# Altium schematic sheet Smoothieboard_v1.1.SchDoc
size A1
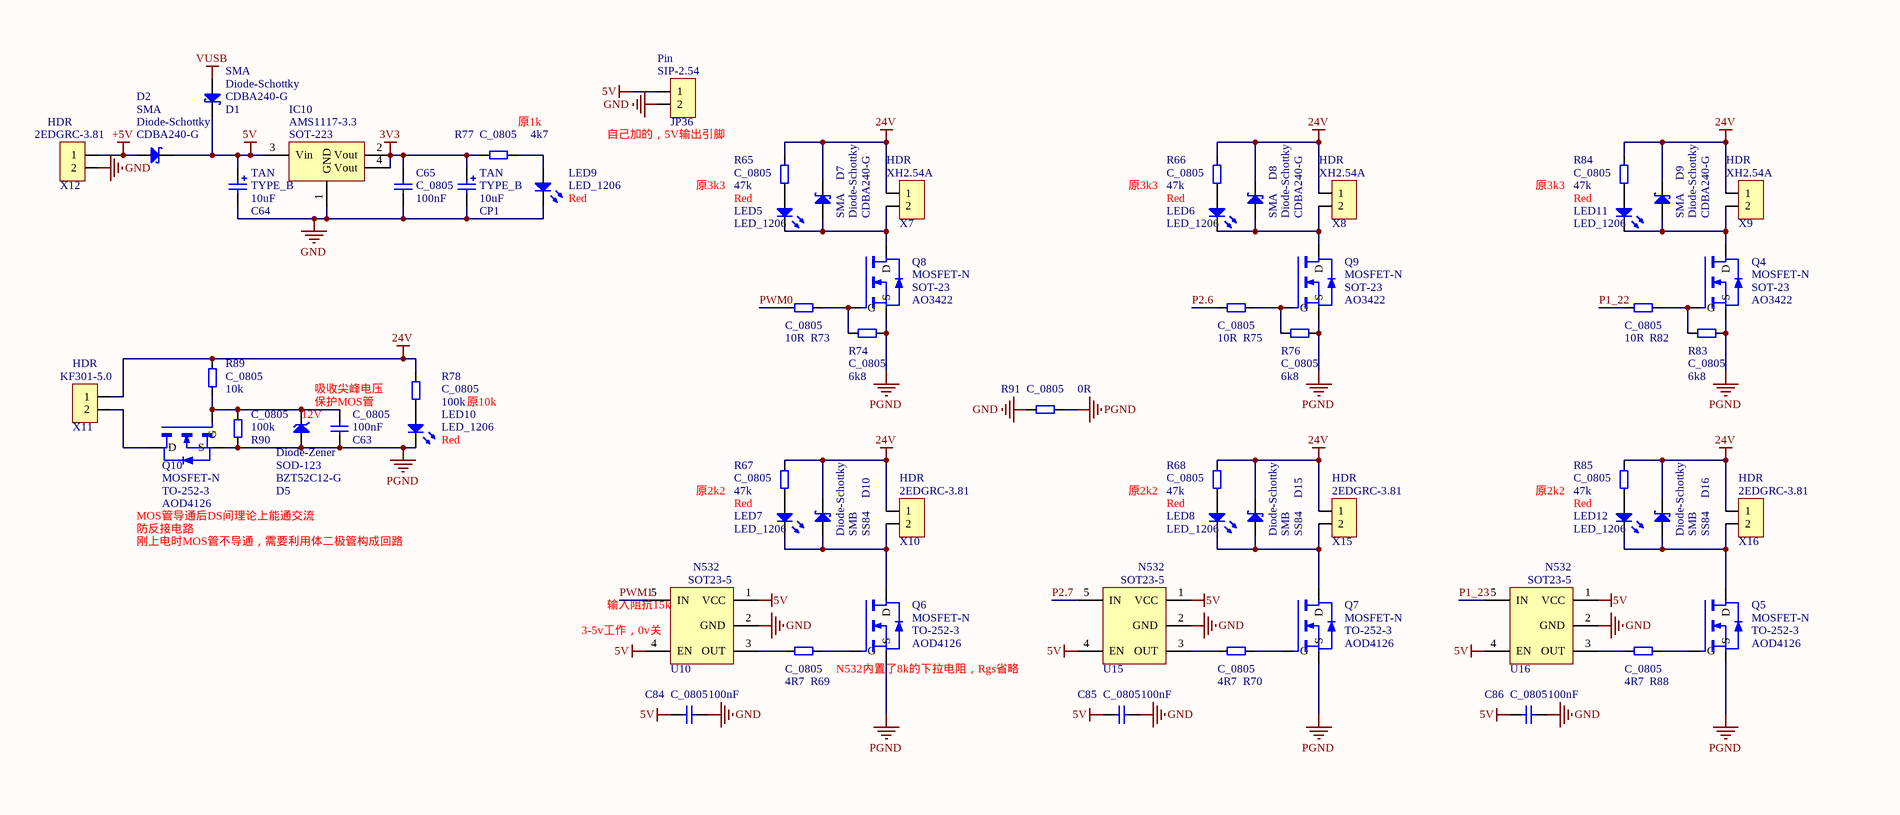
[diagram p0: Smoothieboard_v1.1.SchDoc, top left]
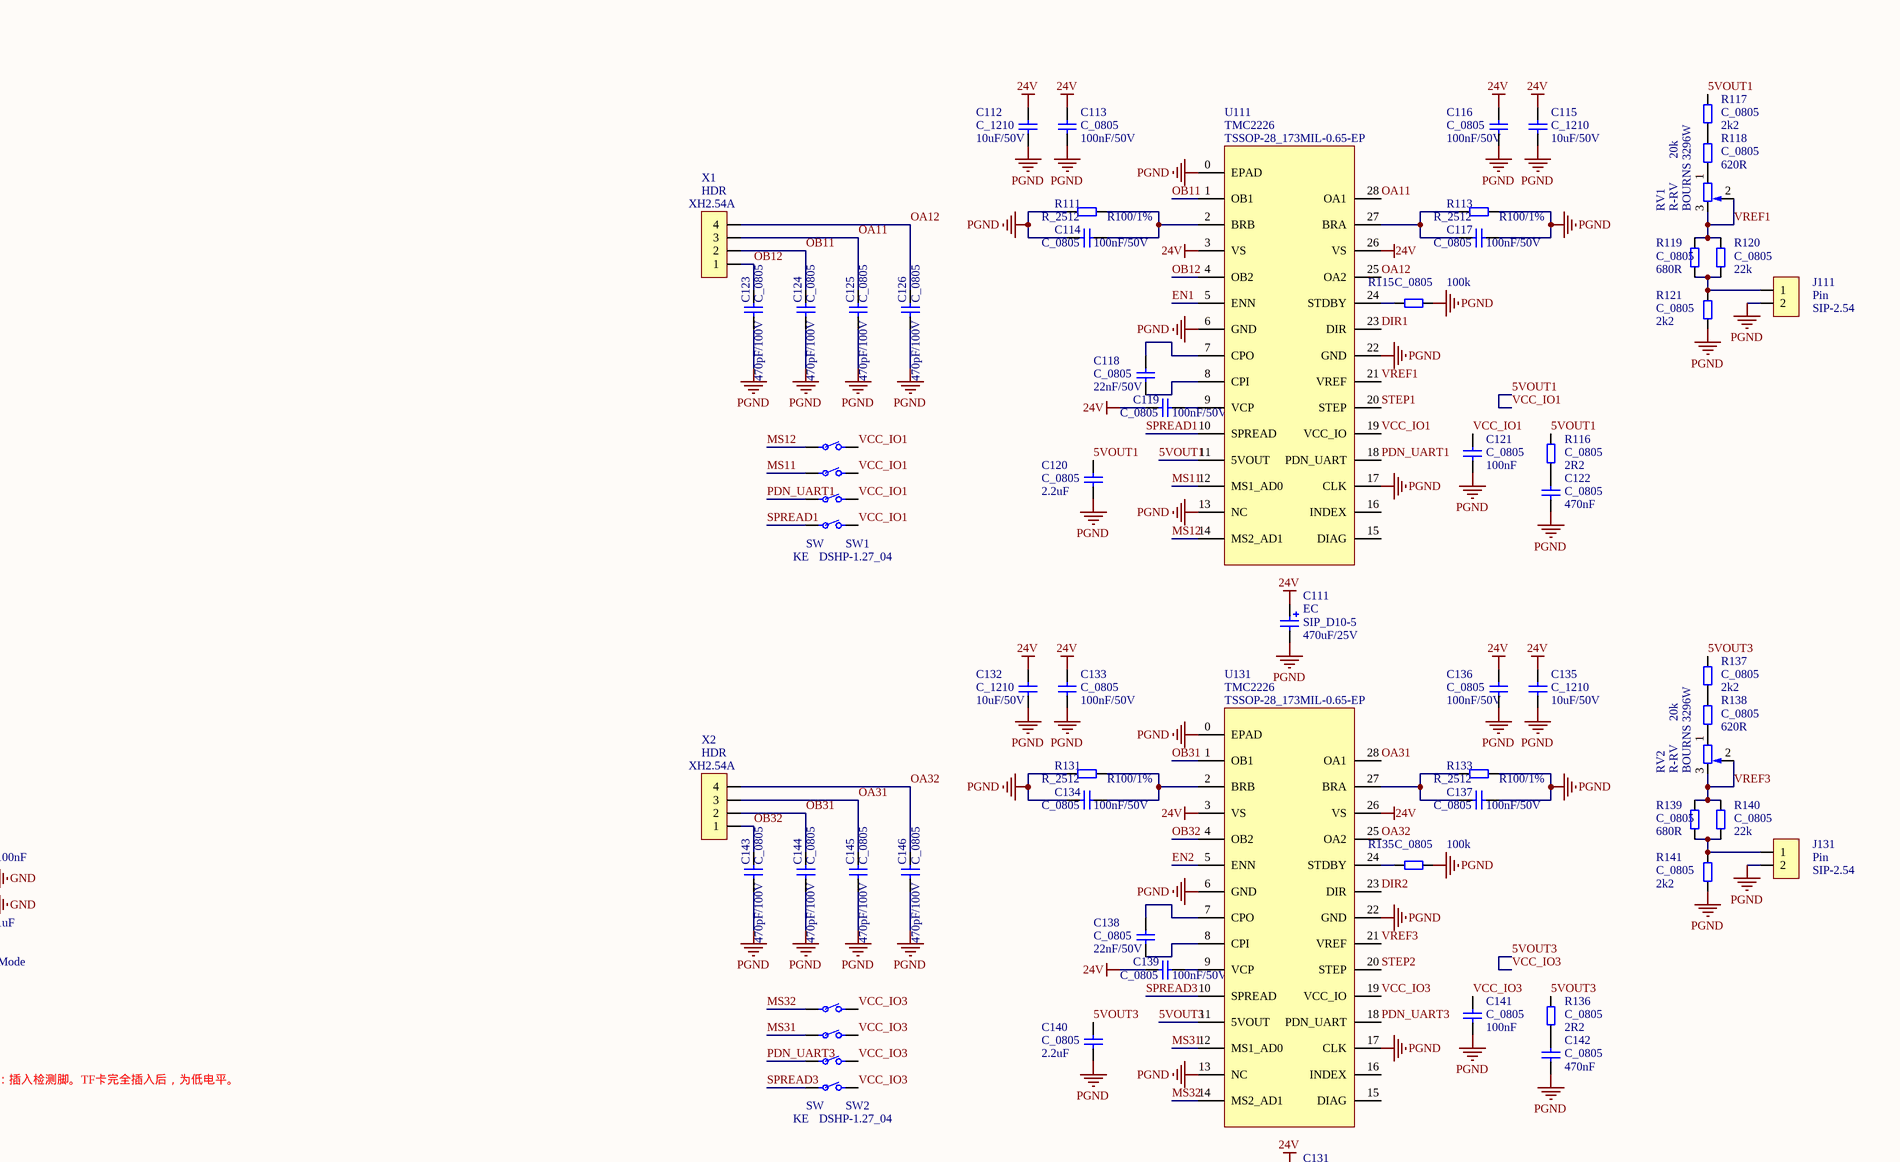
[diagram p1: Smoothieboard_v1.1.SchDoc, top right]
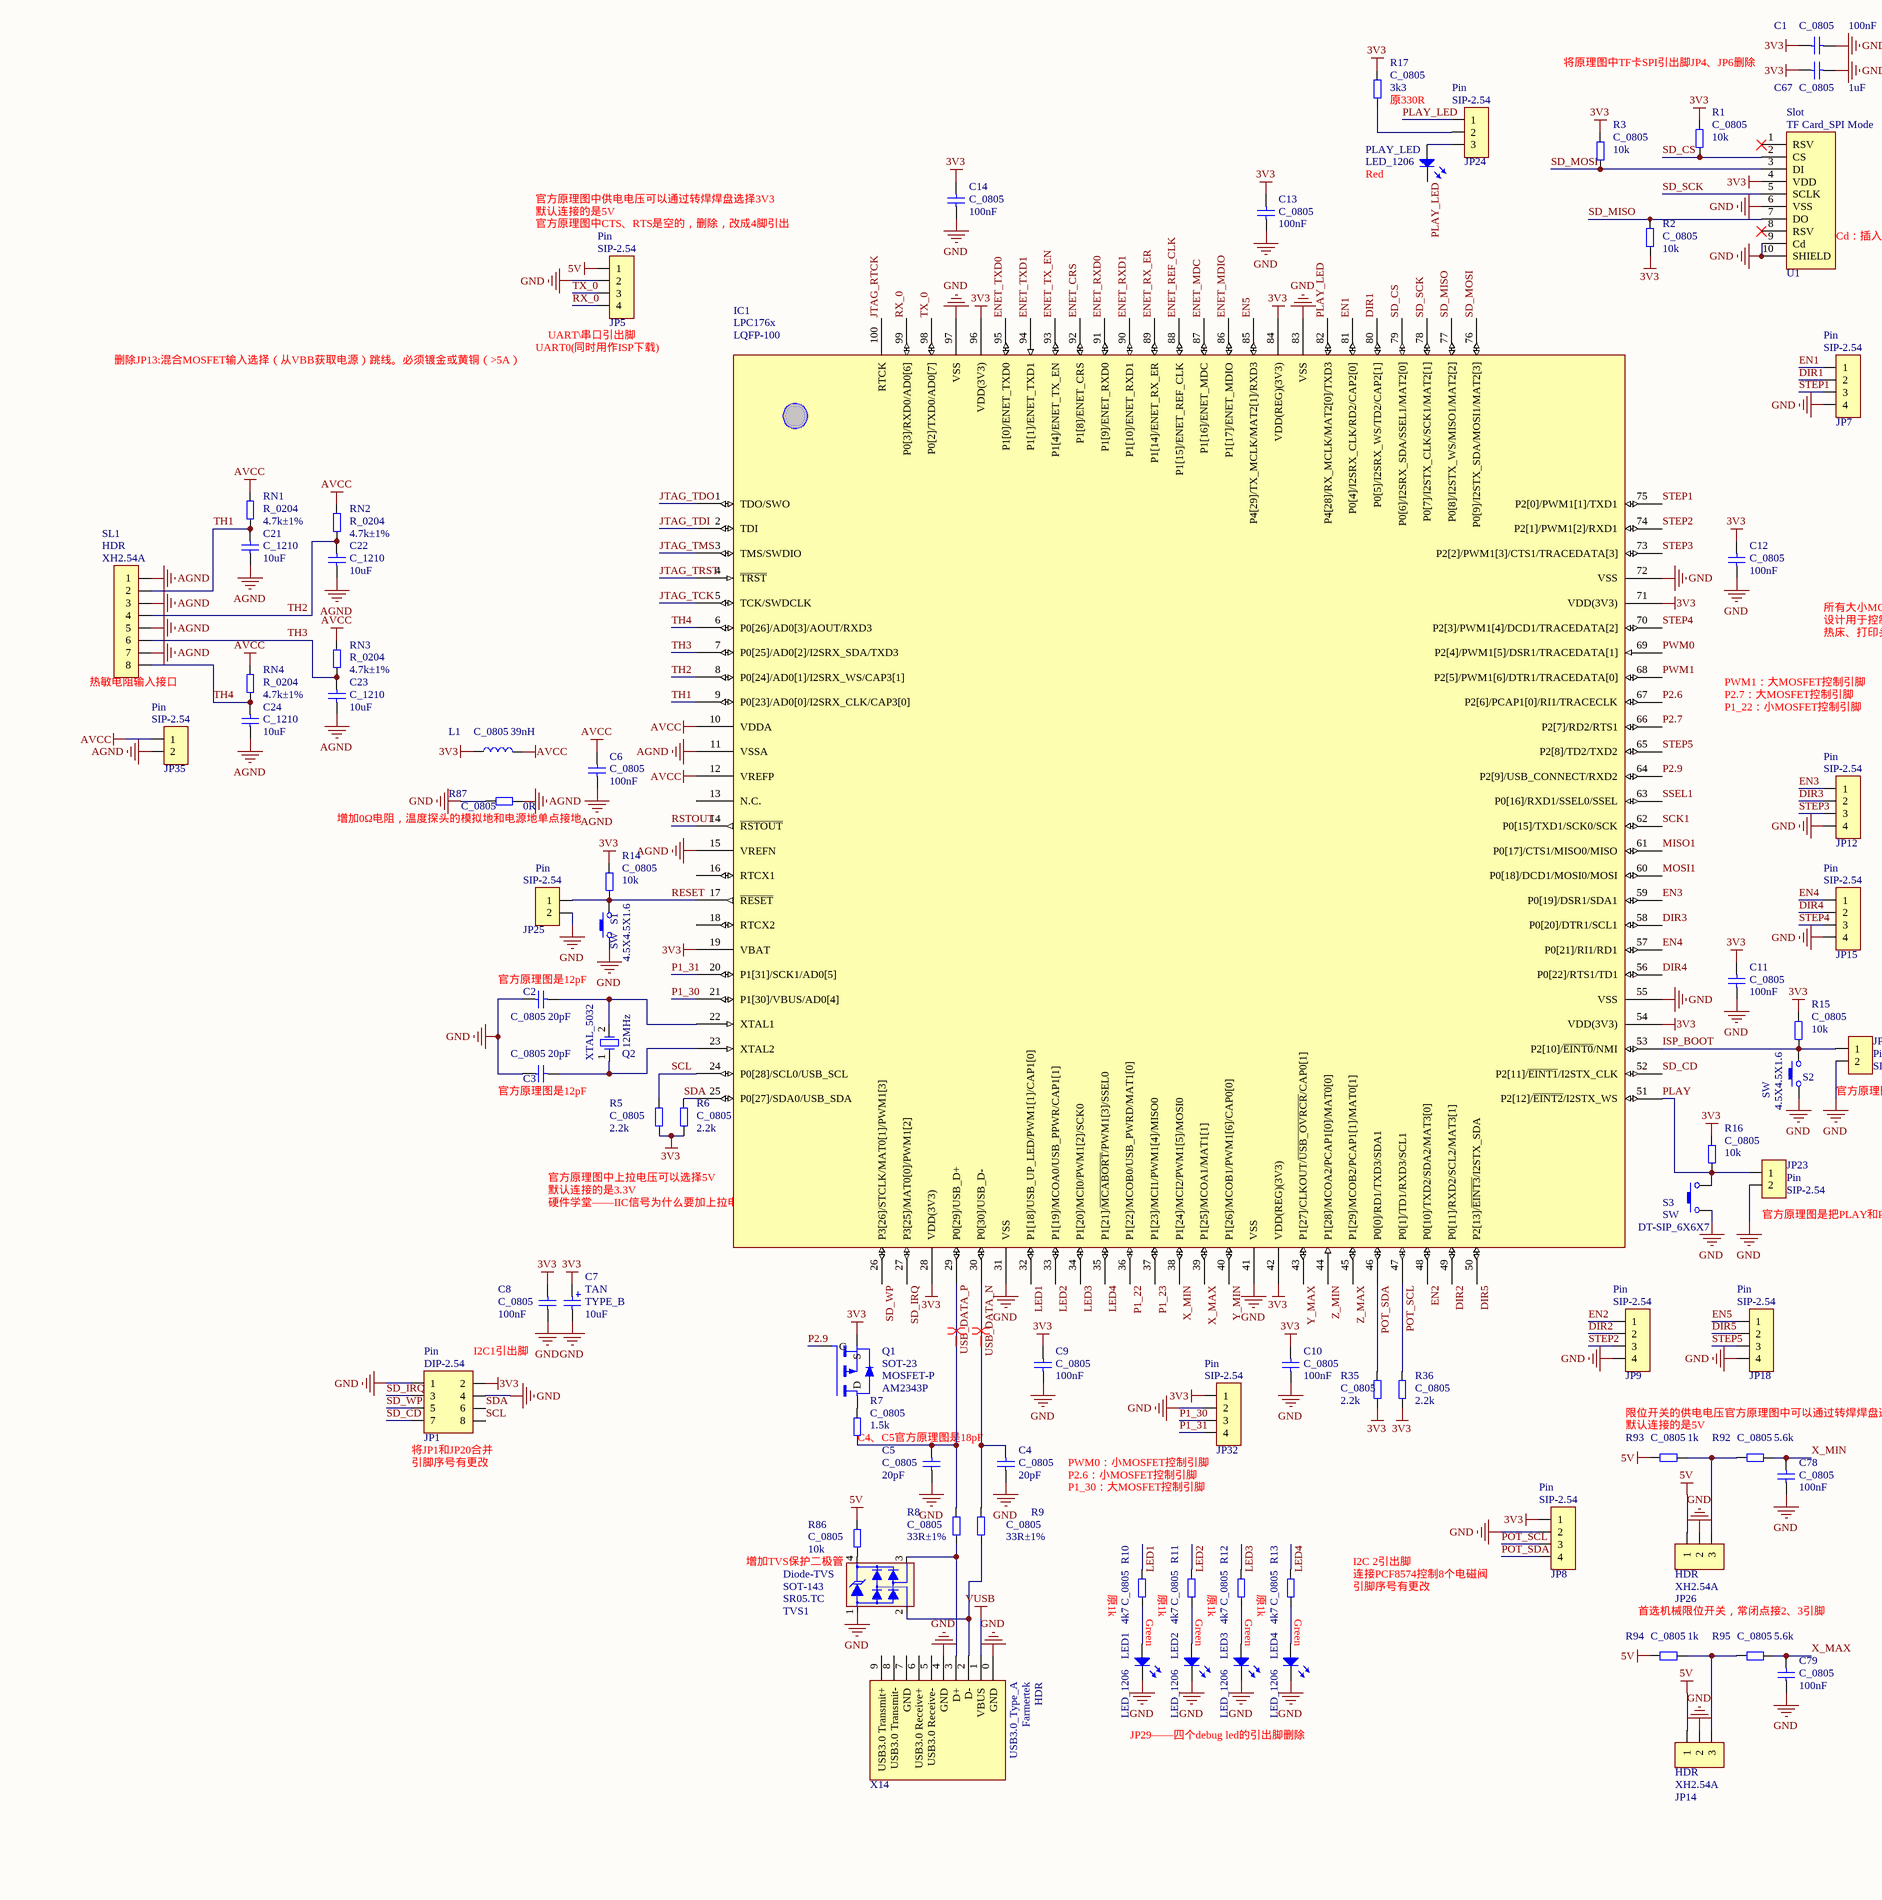
[diagram p2: Smoothieboard_v1.1.SchDoc, bottom left]
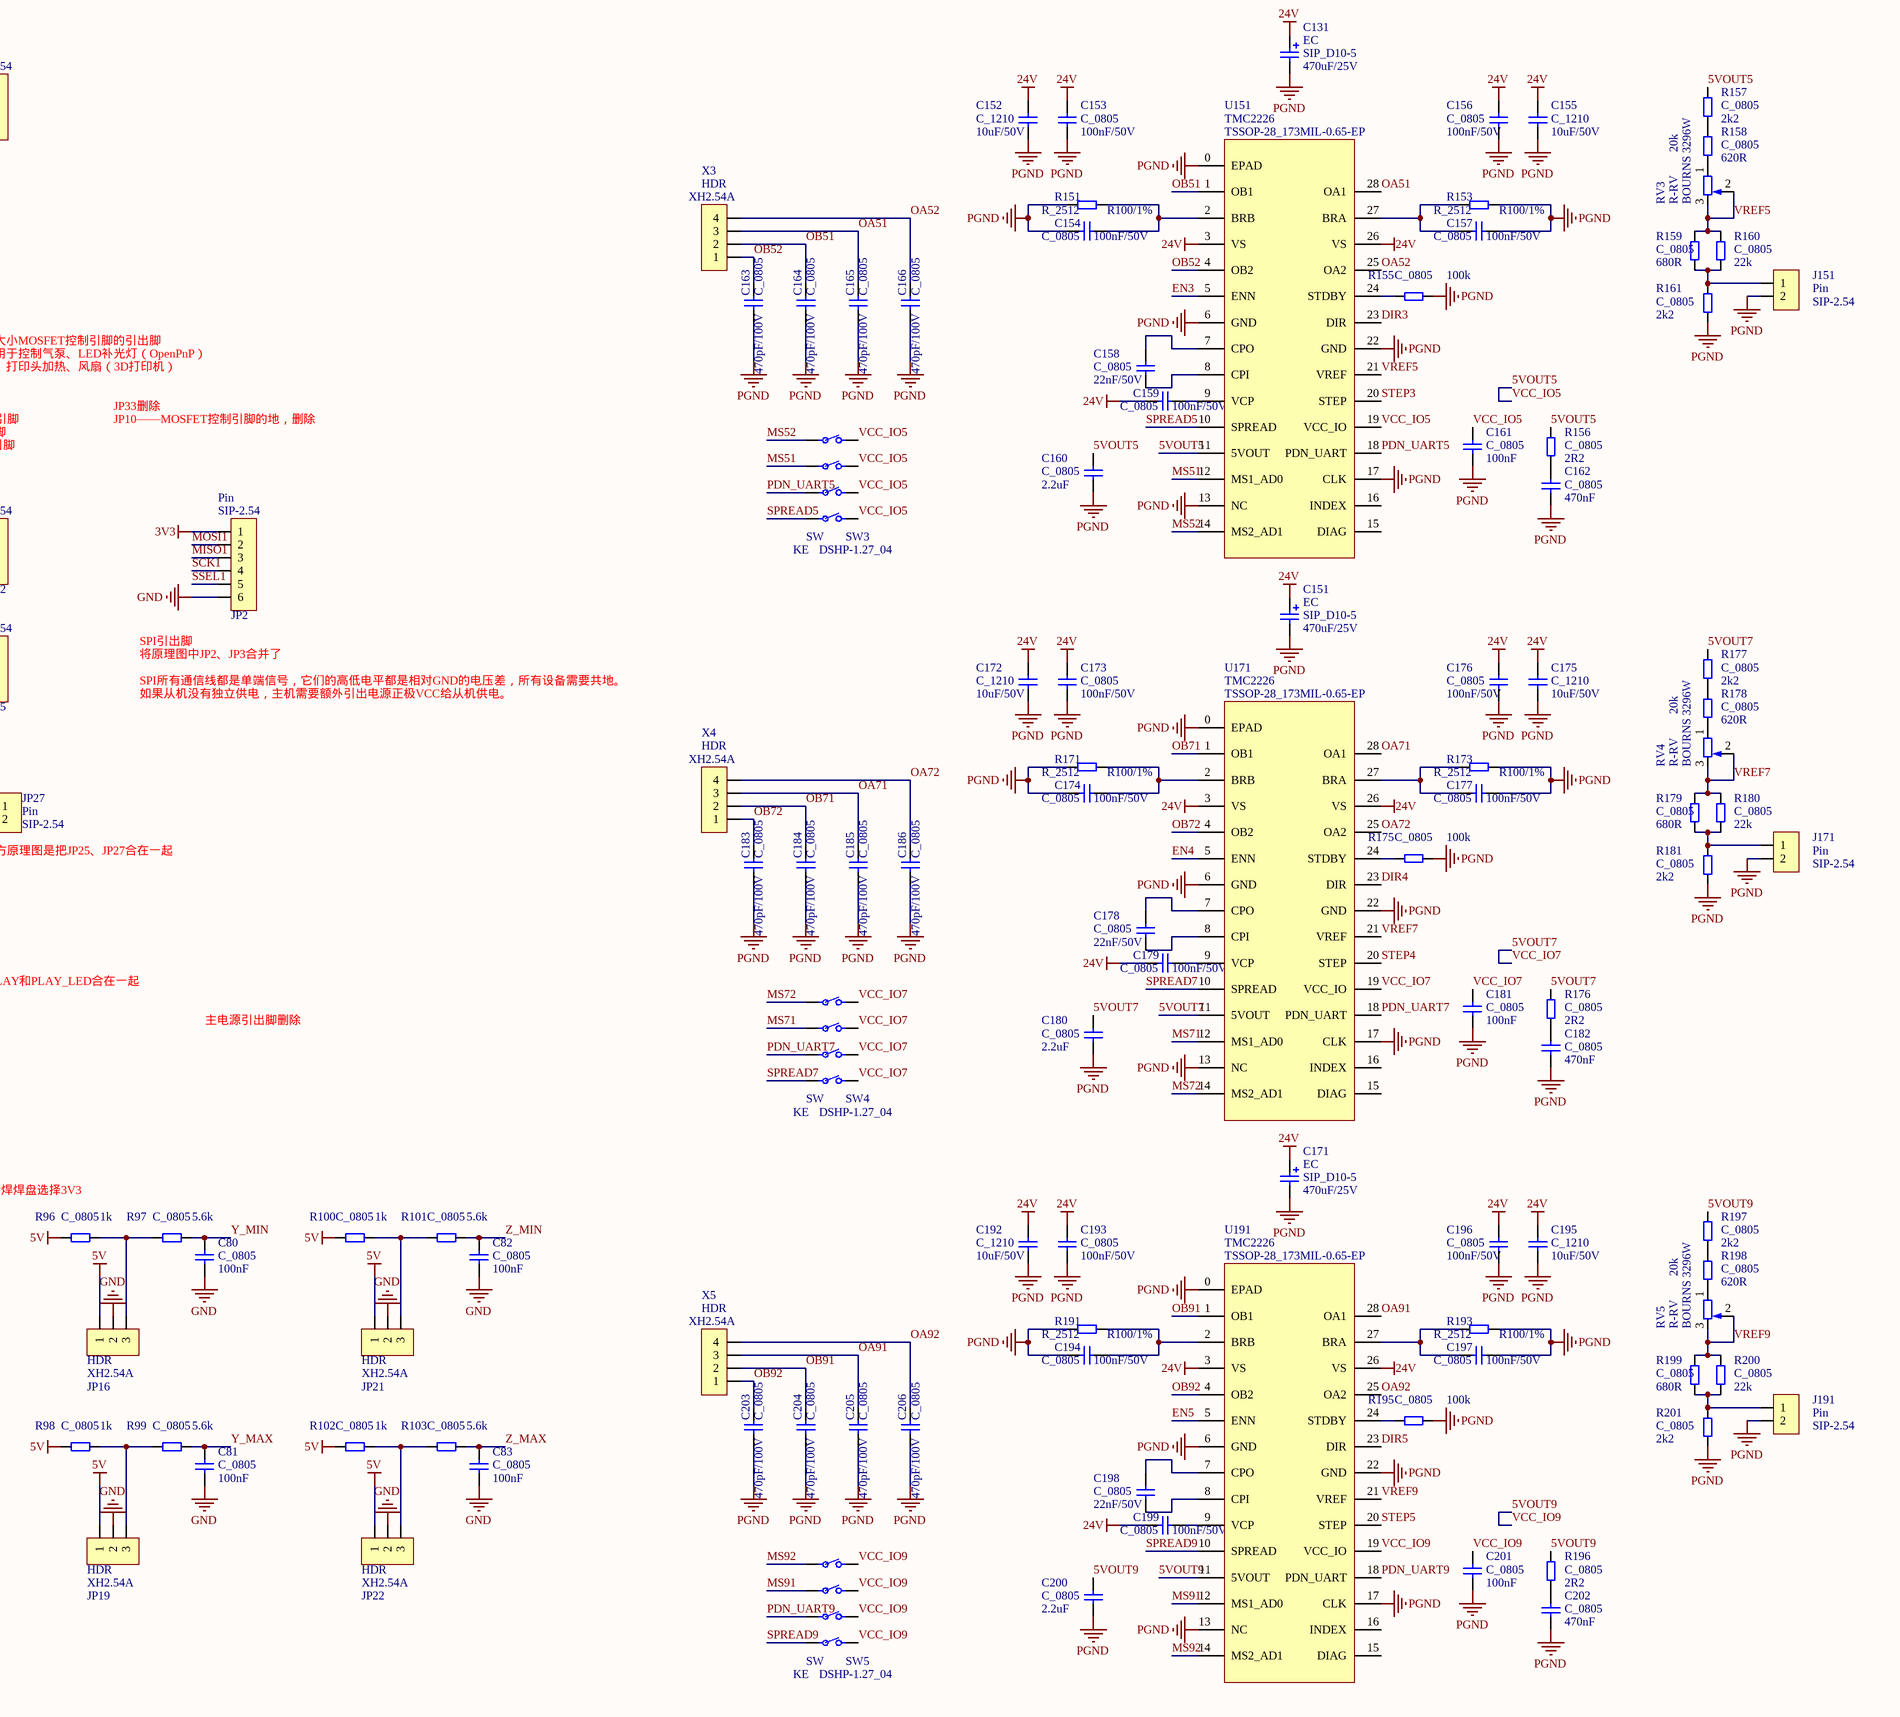
[diagram p3: Smoothieboard_v1.1.SchDoc, bottom right]

## Parts
C1  Type/Value: 100nF  Footprint Index: C_0805  [CAP-MLCC_0805]  (hidden comment: C-MLCC_0805)
C2  Type/Value: 20pF  Footprint Index: C_0805  [CAP-MLCC_0805]  (hidden comment: C-MLCC_0805)
C3  Type/Value: 20pF  Footprint Index: C_0805  [CAP-MLCC_0805]  (hidden comment: C-MLCC_0805)
C4  Type/Value: 20pF  Footprint Index: C_0805  [CAP-MLCC_0805]  (hidden comment: C-MLCC_0805)
C5  Type/Value: 20pF  Footprint Index: C_0805  [CAP-MLCC_0805]  (hidden comment: C-MLCC_0805)
C6  Type/Value: 100nF  Footprint Index: C_0805  [CAP-MLCC_0805]  (hidden comment: C-MLCC_0805)
C7  Footprint Index: TYPE_B  SubClass: TAN  Type/Value: 10uF  [CAP-TAN_TYPE_B]  (hidden comment: C-TAN_Type_B)
C8  Type/Value: 100nF  Footprint Index: C_0805  [CAP-MLCC_0805]  (hidden comment: C-MLCC_0805)
C9  Type/Value: 100nF  Footprint Index: C_0805  [CAP-MLCC_0805]  (hidden comment: C-MLCC_0805)
C10  Type/Value: 100nF  Footprint Index: C_0805  [CAP-MLCC_0805]  (hidden comment: C-MLCC_0805)
C11  Type/Value: 100nF  Footprint Index: C_0805  [CAP-MLCC_0805]  (hidden comment: C-MLCC_0805)
C12  Type/Value: 100nF  Footprint Index: C_0805  [CAP-MLCC_0805]  (hidden comment: C-MLCC_0805)
C13  Type/Value: 100nF  Footprint Index: C_0805  [CAP-MLCC_0805]  (hidden comment: C-MLCC_0805)
C14  Type/Value: 100nF  Footprint Index: C_0805  [CAP-MLCC_0805]  (hidden comment: C-MLCC_0805)
C21  Type/Value: 10uF  Footprint Index: C_1210  [CAP-MLCC_1210]  (hidden comment: C-MLCC_1210)
C22  Type/Value: 10uF  Footprint Index: C_1210  [CAP-MLCC_1210]  (hidden comment: C-MLCC_1210)
C23  Type/Value: 10uF  Footprint Index: C_1210  [CAP-MLCC_1210]  (hidden comment: C-MLCC_1210)
C24  Type/Value: 10uF  Footprint Index: C_1210  [CAP-MLCC_1210]  (hidden comment: C-MLCC_1210)
C63  Type/Value: 100nF  Footprint Index: C_0805  [CAP-MLCC_0805]  (hidden comment: C-MLCC_0805)
C64  Footprint Index: TYPE_B  SubClass: TAN  Type/Value: 10uF  [CAP-TAN_TYPE_B]  (hidden comment: C-TAN_Type_B)
C65  Type/Value: 100nF  Footprint Index: C_0805  [CAP-MLCC_0805]  (hidden comment: C-MLCC_0805)
C67  Type/Value: 1uF  Footprint Index: C_0805  [CAP-MLCC_0805]  (hidden comment: C-MLCC_0805)
C78  Type/Value: 100nF  Footprint Index: C_0805  [CAP-MLCC_0805]  (hidden comment: C-MLCC_0805)
C79  Type/Value: 100nF  Footprint Index: C_0805  [CAP-MLCC_0805]  (hidden comment: C-MLCC_0805)
C80  Type/Value: 100nF  Footprint Index: C_0805  [CAP-MLCC_0805]  (hidden comment: C-MLCC_0805)
C81  Type/Value: 100nF  Footprint Index: C_0805  [CAP-MLCC_0805]  (hidden comment: C-MLCC_0805)
C82  Type/Value: 100nF  Footprint Index: C_0805  [CAP-MLCC_0805]  (hidden comment: C-MLCC_0805)
C83  Type/Value: 100nF  Footprint Index: C_0805  [CAP-MLCC_0805]  (hidden comment: C-MLCC_0805)
C84  Type/Value: 100nF  Footprint Index: C_0805  [CAP-MLCC_0805]  (hidden comment: C-MLCC_0805)
C85  Type/Value: 100nF  Footprint Index: C_0805  [CAP-MLCC_0805]  (hidden comment: C-MLCC_0805)
C86  Type/Value: 100nF  Footprint Index: C_0805  [CAP-MLCC_0805]  (hidden comment: C-MLCC_0805)
C111  Footprint Index: SIP_D10-5  SubClass: EC  Type/Value: 470uF/25V  [CAP-EC-SIP_D10-5]  (hidden comment: C-EC-SIP_D10-5)
C112  Type/Value: 10uF/50V  Footprint Index: C_1210  [CAP-MLCC_1210]  (hidden comment: C-MLCC_1210)
C113  Type/Value: 100nF/50V  Footprint Index: C_0805  [CAP-MLCC_0805]  (hidden comment: C-MLCC_0805)
C114  Type/Value: 100nF/50V  Footprint Index: C_0805  [CAP-MLCC_0805]  (hidden comment: C-MLCC_0805)
C115  Type/Value: 10uF/50V  Footprint Index: C_1210  [CAP-MLCC_1210]  (hidden comment: C-MLCC_1210)
C116  Type/Value: 100nF/50V  Footprint Index: C_0805  [CAP-MLCC_0805]  (hidden comment: C-MLCC_0805)
C117  Type/Value: 100nF/50V  Footprint Index: C_0805  [CAP-MLCC_0805]  (hidden comment: C-MLCC_0805)
C118  Type/Value: 22nF/50V  Footprint Index: C_0805  [CAP-MLCC_0805]  (hidden comment: C-MLCC_0805)
C119  Type/Value: 100nF/50V  Footprint Index: C_0805  [CAP-MLCC_0805]  (hidden comment: C-MLCC_0805)
C120  Type/Value: 2.2uF  Footprint Index: C_0805  [CAP-MLCC_0805]  (hidden comment: C-MLCC_0805)
C121  Type/Value: 100nF  Footprint Index: C_0805  [CAP-MLCC_0805]  (hidden comment: C-MLCC_0805)
C122  Type/Value: 470nF  Footprint Index: C_0805  [CAP-MLCC_0805]  (hidden comment: C-MLCC_0805)
C123  Type/Value: 470pF/100V  Footprint Index: C_0805  [CAP-MLCC_0805]  (hidden comment: C-MLCC_0805)
C124  Type/Value: 470pF/100V  Footprint Index: C_0805  [CAP-MLCC_0805]  (hidden comment: C-MLCC_0805)
C125  Type/Value: 470pF/100V  Footprint Index: C_0805  [CAP-MLCC_0805]  (hidden comment: C-MLCC_0805)
C126  Type/Value: 470pF/100V  Footprint Index: C_0805  [CAP-MLCC_0805]  (hidden comment: C-MLCC_0805)
C131  Footprint Index: SIP_D10-5  SubClass: EC  Type/Value: 470uF/25V  [CAP-EC-SIP_D10-5]  (hidden comment: C-EC-SIP_D10-5)
C132  Type/Value: 10uF/50V  Footprint Index: C_1210  [CAP-MLCC_1210]  (hidden comment: C-MLCC_1210)
C133  Type/Value: 100nF/50V  Footprint Index: C_0805  [CAP-MLCC_0805]  (hidden comment: C-MLCC_0805)
C134  Type/Value: 100nF/50V  Footprint Index: C_0805  [CAP-MLCC_0805]  (hidden comment: C-MLCC_0805)
C135  Type/Value: 10uF/50V  Footprint Index: C_1210  [CAP-MLCC_1210]  (hidden comment: C-MLCC_1210)
C136  Type/Value: 100nF/50V  Footprint Index: C_0805  [CAP-MLCC_0805]  (hidden comment: C-MLCC_0805)
C137  Type/Value: 100nF/50V  Footprint Index: C_0805  [CAP-MLCC_0805]  (hidden comment: C-MLCC_0805)
C138  Type/Value: 22nF/50V  Footprint Index: C_0805  [CAP-MLCC_0805]  (hidden comment: C-MLCC_0805)
C139  Type/Value: 100nF/50V  Footprint Index: C_0805  [CAP-MLCC_0805]  (hidden comment: C-MLCC_0805)
C140  Type/Value: 2.2uF  Footprint Index: C_0805  [CAP-MLCC_0805]  (hidden comment: C-MLCC_0805)
C141  Type/Value: 100nF  Footprint Index: C_0805  [CAP-MLCC_0805]  (hidden comment: C-MLCC_0805)
C142  Type/Value: 470nF  Footprint Index: C_0805  [CAP-MLCC_0805]  (hidden comment: C-MLCC_0805)
C143  Type/Value: 470pF/100V  Footprint Index: C_0805  [CAP-MLCC_0805]  (hidden comment: C-MLCC_0805)
C144  Type/Value: 470pF/100V  Footprint Index: C_0805  [CAP-MLCC_0805]  (hidden comment: C-MLCC_0805)
C145  Type/Value: 470pF/100V  Footprint Index: C_0805  [CAP-MLCC_0805]  (hidden comment: C-MLCC_0805)
C146  Type/Value: 470pF/100V  Footprint Index: C_0805  [CAP-MLCC_0805]  (hidden comment: C-MLCC_0805)
C151  Footprint Index: SIP_D10-5  SubClass: EC  Type/Value: 470uF/25V  [CAP-EC-SIP_D10-5]  (hidden comment: C-EC-SIP_D10-5)
C152  Type/Value: 10uF/50V  Footprint Index: C_1210  [CAP-MLCC_1210]  (hidden comment: C-MLCC_1210)
C153  Type/Value: 100nF/50V  Footprint Index: C_0805  [CAP-MLCC_0805]  (hidden comment: C-MLCC_0805)
C154  Type/Value: 100nF/50V  Footprint Index: C_0805  [CAP-MLCC_0805]  (hidden comment: C-MLCC_0805)
C155  Type/Value: 10uF/50V  Footprint Index: C_1210  [CAP-MLCC_1210]  (hidden comment: C-MLCC_1210)
C156  Type/Value: 100nF/50V  Footprint Index: C_0805  [CAP-MLCC_0805]  (hidden comment: C-MLCC_0805)
C157  Type/Value: 100nF/50V  Footprint Index: C_0805  [CAP-MLCC_0805]  (hidden comment: C-MLCC_0805)
C158  Type/Value: 22nF/50V  Footprint Index: C_0805  [CAP-MLCC_0805]  (hidden comment: C-MLCC_0805)
C159  Type/Value: 100nF/50V  Footprint Index: C_0805  [CAP-MLCC_0805]  (hidden comment: C-MLCC_0805)
C160  Type/Value: 2.2uF  Footprint Index: C_0805  [CAP-MLCC_0805]  (hidden comment: C-MLCC_0805)
C161  Type/Value: 100nF  Footprint Index: C_0805  [CAP-MLCC_0805]  (hidden comment: C-MLCC_0805)
C162  Type/Value: 470nF  Footprint Index: C_0805  [CAP-MLCC_0805]  (hidden comment: C-MLCC_0805)
C163  Type/Value: 470pF/100V  Footprint Index: C_0805  [CAP-MLCC_0805]  (hidden comment: C-MLCC_0805)
C164  Type/Value: 470pF/100V  Footprint Index: C_0805  [CAP-MLCC_0805]  (hidden comment: C-MLCC_0805)
C165  Type/Value: 470pF/100V  Footprint Index: C_0805  [CAP-MLCC_0805]  (hidden comment: C-MLCC_0805)
C166  Type/Value: 470pF/100V  Footprint Index: C_0805  [CAP-MLCC_0805]  (hidden comment: C-MLCC_0805)
C171  Footprint Index: SIP_D10-5  SubClass: EC  Type/Value: 470uF/25V  [CAP-EC-SIP_D10-5]  (hidden comment: C-EC-SIP_D10-5)
C172  Type/Value: 10uF/50V  Footprint Index: C_1210  [CAP-MLCC_1210]  (hidden comment: C-MLCC_1210)
C173  Type/Value: 100nF/50V  Footprint Index: C_0805  [CAP-MLCC_0805]  (hidden comment: C-MLCC_0805)
C174  Type/Value: 100nF/50V  Footprint Index: C_0805  [CAP-MLCC_0805]  (hidden comment: C-MLCC_0805)
C175  Type/Value: 10uF/50V  Footprint Index: C_1210  [CAP-MLCC_1210]  (hidden comment: C-MLCC_1210)
C176  Type/Value: 100nF/50V  Footprint Index: C_0805  [CAP-MLCC_0805]  (hidden comment: C-MLCC_0805)
C177  Type/Value: 100nF/50V  Footprint Index: C_0805  [CAP-MLCC_0805]  (hidden comment: C-MLCC_0805)
C178  Type/Value: 22nF/50V  Footprint Index: C_0805  [CAP-MLCC_0805]  (hidden comment: C-MLCC_0805)
C179  Type/Value: 100nF/50V  Footprint Index: C_0805  [CAP-MLCC_0805]  (hidden comment: C-MLCC_0805)
C180  Type/Value: 2.2uF  Footprint Index: C_0805  [CAP-MLCC_0805]  (hidden comment: C-MLCC_0805)
C181  Type/Value: 100nF  Footprint Index: C_0805  [CAP-MLCC_0805]  (hidden comment: C-MLCC_0805)
C182  Type/Value: 470nF  Footprint Index: C_0805  [CAP-MLCC_0805]  (hidden comment: C-MLCC_0805)
C183  Type/Value: 470pF/100V  Footprint Index: C_0805  [CAP-MLCC_0805]  (hidden comment: C-MLCC_0805)
C184  Type/Value: 470pF/100V  Footprint Index: C_0805  [CAP-MLCC_0805]  (hidden comment: C-MLCC_0805)
C185  Type/Value: 470pF/100V  Footprint Index: C_0805  [CAP-MLCC_0805]  (hidden comment: C-MLCC_0805)
C186  Type/Value: 470pF/100V  Footprint Index: C_0805  [CAP-MLCC_0805]  (hidden comment: C-MLCC_0805)
C192  Type/Value: 10uF/50V  Footprint Index: C_1210  [CAP-MLCC_1210]  (hidden comment: C-MLCC_1210)
C193  Type/Value: 100nF/50V  Footprint Index: C_0805  [CAP-MLCC_0805]  (hidden comment: C-MLCC_0805)
C194  Type/Value: 100nF/50V  Footprint Index: C_0805  [CAP-MLCC_0805]  (hidden comment: C-MLCC_0805)
C195  Type/Value: 10uF/50V  Footprint Index: C_1210  [CAP-MLCC_1210]  (hidden comment: C-MLCC_1210)
C196  Type/Value: 100nF/50V  Footprint Index: C_0805  [CAP-MLCC_0805]  (hidden comment: C-MLCC_0805)
C197  Type/Value: 100nF/50V  Footprint Index: C_0805  [CAP-MLCC_0805]  (hidden comment: C-MLCC_0805)
C198  Type/Value: 22nF/50V  Footprint Index: C_0805  [CAP-MLCC_0805]  (hidden comment: C-MLCC_0805)
C199  Type/Value: 100nF/50V  Footprint Index: C_0805  [CAP-MLCC_0805]  (hidden comment: C-MLCC_0805)
C200  Type/Value: 2.2uF  Footprint Index: C_0805  [CAP-MLCC_0805]  (hidden comment: C-MLCC_0805)
C201  Type/Value: 100nF  Footprint Index: C_0805  [CAP-MLCC_0805]  (hidden comment: C-MLCC_0805)
C202  Type/Value: 470nF  Footprint Index: C_0805  [CAP-MLCC_0805]  (hidden comment: C-MLCC_0805)
C203  Type/Value: 470pF/100V  Footprint Index: C_0805  [CAP-MLCC_0805]  (hidden comment: C-MLCC_0805)
C204  Type/Value: 470pF/100V  Footprint Index: C_0805  [CAP-MLCC_0805]  (hidden comment: C-MLCC_0805)
C205  Type/Value: 470pF/100V  Footprint Index: C_0805  [CAP-MLCC_0805]  (hidden comment: C-MLCC_0805)
C206  Type/Value: 470pF/100V  Footprint Index: C_0805  [CAP-MLCC_0805]  (hidden comment: C-MLCC_0805)
CP1  Footprint Index: TYPE_B  SubClass: TAN  Type/Value: 10uF  [CAP-TAN_TYPE_B]  (hidden comment: C-TAN_Type_B)
D1  SubClass: Diode-Schottky  Type/Value: CDBA240-G  [SMA]  (hidden comment: Diode-Schottky_SMA)
D2  SubClass: Diode-Schottky  Type/Value: CDBA240-G  [SMA]  (hidden comment: Diode-Schottky_SMA)
D5  SubClass: Diode-Zener  Type/Value: BZT52C12-G  [SOD-123]  (hidden comment: Diode-Zener_SOD-123)
D7  SubClass: Diode-Schottky  Type/Value: CDBA240-G  [SMA]  (hidden comment: Diode-Schottky_SMA)
D8  SubClass: Diode-Schottky  Type/Value: CDBA240-G  [SMA]  (hidden comment: Diode-Schottky_SMA)
D9  SubClass: Diode-Schottky  Type/Value: CDBA240-G  [SMA]  (hidden comment: Diode-Schottky_SMA)
D10  SubClass: Diode-Schottky  Type/Value: SS84  [SMB]  (hidden comment: Diode-Schottky_SMB)
D15  SubClass: Diode-Schottky  Type/Value: SS84  [SMB]  (hidden comment: Diode-Schottky_SMB)
D16  SubClass: Diode-Schottky  Type/Value: SS84  [SMB]  (hidden comment: Diode-Schottky_SMB)
IC1  Type: LPC176x  [LQFP-100]  (hidden comment: MCU-LPC176x)
IC10  Type: AMS1117-3.3  [SOT-223]  (hidden comment: LDO-AMS1117-3.3)
J111  Footprint Index: SIP-2.54  Class: Pin  [PIN-SIP-2.54_1X2]  (hidden comment: Pin-2.54_1x2)
J131  Footprint Index: SIP-2.54  Class: Pin  [PIN-SIP-2.54_1X2]  (hidden comment: Pin-2.54_1x2)
J151  Footprint Index: SIP-2.54  Class: Pin  [PIN-SIP-2.54_1X2]  (hidden comment: Pin-2.54_1x2)
J171  Footprint Index: SIP-2.54  Class: Pin  [PIN-SIP-2.54_1X2]  (hidden comment: Pin-2.54_1x2)
J191  Footprint Index: SIP-2.54  Class: Pin  [PIN-SIP-2.54_1X2]  (hidden comment: Pin-2.54_1x2)
JP1  Footprint Index: DIP-2.54  Class: Pin  [PIN-DIP-2.54_2X4]  (hidden comment: Pin-2.54_2x4)
JP2  Footprint Index: SIP-2.54  Class: Pin  [PIN-SIP-2.54_1X6]  (hidden comment: Pin-2.54_1x6)
JP5  Footprint Index: SIP-2.54  Class: Pin  [PIN-SIP-2.54_1X4]  (hidden comment: Pin-2.54_1x4)
JP7  Footprint Index: SIP-2.54  Class: Pin  [PIN-SIP-2.54_1X4]  (hidden comment: Pin-2.54_1x4)
JP8  Footprint Index: SIP-2.54  Class: Pin  [PIN-SIP-2.54_1X4]  (hidden comment: Pin-2.54_1x4)
JP9  Footprint Index: SIP-2.54  Class: Pin  [PIN-SIP-2.54_1X4]  (hidden comment: Pin-2.54_1x4)
JP12  Footprint Index: SIP-2.54  Class: Pin  [PIN-SIP-2.54_1X4]  (hidden comment: Pin-2.54_1x4)
JP14  Footprint Index: XH2.54A  Class: HDR  [HDR-XH2.54A_3P]  (hidden comment: HDR-XH2.54A_3P)
JP15  Footprint Index: SIP-2.54  Class: Pin  [PIN-SIP-2.54_1X4]  (hidden comment: Pin-2.54_1x4)
JP16  Footprint Index: XH2.54A  Class: HDR  [HDR-XH2.54A_3P]  (hidden comment: HDR-XH2.54A_3P)
JP18  Footprint Index: SIP-2.54  Class: Pin  [PIN-SIP-2.54_1X4]  (hidden comment: Pin-2.54_1x4)
JP19  Footprint Index: XH2.54A  Class: HDR  [HDR-XH2.54A_3P]  (hidden comment: HDR-XH2.54A_3P)
JP21  Footprint Index: XH2.54A  Class: HDR  [HDR-XH2.54A_3P]  (hidden comment: HDR-XH2.54A_3P)
JP22  Footprint Index: XH2.54A  Class: HDR  [HDR-XH2.54A_3P]  (hidden comment: HDR-XH2.54A_3P)
JP23  Footprint Index: SIP-2.54  Class: Pin  [PIN-SIP-2.54_1X2]  (hidden comment: Pin-2.54_1x2)
JP24  Footprint Index: SIP-2.54  Class: Pin  [PIN-SIP-2.54_1X3]  (hidden comment: Pin-2.54_1x3)
JP25  Footprint Index: SIP-2.54  Class: Pin  [PIN-SIP-2.54_1X2]  (hidden comment: Pin-2.54_1x2)
JP26  Footprint Index: XH2.54A  Class: HDR  [HDR-XH2.54A_3P]  (hidden comment: HDR-XH2.54A_3P)
JP27  Footprint Index: SIP-2.54  Class: Pin  [PIN-SIP-2.54_1X2]  (hidden comment: Pin-2.54_1x2)
JP32  Footprint Index: SIP-2.54  Class: Pin  [PIN-SIP-2.54_1X4]  (hidden comment: Pin-2.54_1x4)
JP35  Footprint Index: SIP-2.54  Class: Pin  [PIN-SIP-2.54_1X2]  (hidden comment: Pin-2.54_1x2)
JP36  Footprint Index: SIP-2.54  Class: Pin  [PIN-SIP-2.54_1X2]  (hidden comment: Pin-2.54_1x2)
L1  Footprint Index: C_0805  Type/Value: 39nH  [CAP-MLCC_0805]  (hidden comment: L_0805)
LED1  LED_1206  [LED_1206]
LED2  LED_1206  [LED_1206]
LED3  LED_1206  [LED_1206]
LED4  LED_1206  [LED_1206]
LED5  LED_1206  [LED_1206]
LED6  LED_1206  [LED_1206]
LED7  LED_1206  [LED_1206]
LED8  LED_1206  [LED_1206]
LED9  LED_1206  [LED_1206]
LED10  LED_1206  [LED_1206]
LED11  LED_1206  [LED_1206]
LED12  LED_1206  [LED_1206]
PLAY_LED  LED_1206  [LED_1206]
Q1  SubClass: MOSFET-P  Type/Value: AM2343P  [SOT-23]  (hidden comment: MOSFET-P_SOT-23)
Q2  Type/Value: 12MHz  [XTAL_5032]  (hidden comment: XTAL_5032)
Q4  SubClass: MOSFET-N  Type/Value: AO3422  [SOT-23]  (hidden comment: MOSFET-N_SOT-23)
Q5  SubClass: MOSFET-N  Type/Value: AOD4126  [TO-252-3]  (hidden comment: MOSFET-N_TO-252-3)
Q6  SubClass: MOSFET-N  Type/Value: AOD4126  [TO-252-3]  (hidden comment: MOSFET-N_TO-252-3)
Q7  SubClass: MOSFET-N  Type/Value: AOD4126  [TO-252-3]  (hidden comment: MOSFET-N_TO-252-3)
Q8  SubClass: MOSFET-N  Type/Value: AO3422  [SOT-23]  (hidden comment: MOSFET-N_SOT-23)
Q9  SubClass: MOSFET-N  Type/Value: AO3422  [SOT-23]  (hidden comment: MOSFET-N_SOT-23)
Q10  SubClass: MOSFET-N  Type/Value: AOD4126  [TO-252-3]  (hidden comment: MOSFET-N_TO-252-3)
R1  Footprint Index: C_0805  Type/Value: 10k  [CAP-MLCC_0805]  (hidden comment: R_0805)
R2  Footprint Index: C_0805  Type/Value: 10k  [CAP-MLCC_0805]  (hidden comment: R_0805)
R3  Footprint Index: C_0805  Type/Value: 10k  [CAP-MLCC_0805]  (hidden comment: R_0805)
R5  Footprint Index: C_0805  Type/Value: 2.2k  [CAP-MLCC_0805]  (hidden comment: R_0805)
R6  Footprint Index: C_0805  Type/Value: 2.2k  [CAP-MLCC_0805]  (hidden comment: R_0805)
R7  Footprint Index: C_0805  Type/Value: 1.5k  [CAP-MLCC_0805]  (hidden comment: R_0805)
R8  Footprint Index: C_0805  Type/Value: 33R±1%  [CAP-MLCC_0805]  (hidden comment: R_0805)
R9  Footprint Index: C_0805  Type/Value: 33R±1%  [CAP-MLCC_0805]  (hidden comment: R_0805)
R10  Footprint Index: C_0805  Type/Value: 4k7  [CAP-MLCC_0805]  (hidden comment: R_0805)
R11  Footprint Index: C_0805  Type/Value: 4k7  [CAP-MLCC_0805]  (hidden comment: R_0805)
R12  Footprint Index: C_0805  Type/Value: 4k7  [CAP-MLCC_0805]  (hidden comment: R_0805)
R13  Footprint Index: C_0805  Type/Value: 4k7  [CAP-MLCC_0805]  (hidden comment: R_0805)
R14  Footprint Index: C_0805  Type/Value: 10k  [CAP-MLCC_0805]  (hidden comment: R_0805)
R15  Footprint Index: C_0805  Type/Value: 10k  [CAP-MLCC_0805]  (hidden comment: R_0805)
R16  Footprint Index: C_0805  Type/Value: 10k  [CAP-MLCC_0805]  (hidden comment: R_0805)
R17  Footprint Index: C_0805  Type/Value: 3k3  [CAP-MLCC_0805]  (hidden comment: R_0805)
R35  Footprint Index: C_0805  Type/Value: 2.2k  [CAP-MLCC_0805]  (hidden comment: R_0805)
R36  Footprint Index: C_0805  Type/Value: 2.2k  [CAP-MLCC_0805]  (hidden comment: R_0805)
R65  Footprint Index: C_0805  Type/Value: 47k  [CAP-MLCC_0805]  (hidden comment: R_0805)
R66  Footprint Index: C_0805  Type/Value: 47k  [CAP-MLCC_0805]  (hidden comment: R_0805)
R67  Footprint Index: C_0805  Type/Value: 47k  [CAP-MLCC_0805]  (hidden comment: R_0805)
R68  Footprint Index: C_0805  Type/Value: 47k  [CAP-MLCC_0805]  (hidden comment: R_0805)
R69  Footprint Index: C_0805  Type/Value: 4R7  [CAP-MLCC_0805]  (hidden comment: R_0805)
R70  Footprint Index: C_0805  Type/Value: 4R7  [CAP-MLCC_0805]  (hidden comment: R_0805)
R73  Footprint Index: C_0805  Type/Value: 10R  [CAP-MLCC_0805]  (hidden comment: R_0805)
R74  Footprint Index: C_0805  Type/Value: 6k8  [CAP-MLCC_0805]  (hidden comment: R_0805)
R75  Footprint Index: C_0805  Type/Value: 10R  [CAP-MLCC_0805]  (hidden comment: R_0805)
R76  Footprint Index: C_0805  Type/Value: 6k8  [CAP-MLCC_0805]  (hidden comment: R_0805)
R77  Footprint Index: C_0805  Type/Value: 4k7  [CAP-MLCC_0805]  (hidden comment: R_0805)
R78  Footprint Index: C_0805  Type/Value: 100k  [CAP-MLCC_0805]  (hidden comment: R_0805)
R82  Footprint Index: C_0805  Type/Value: 10R  [CAP-MLCC_0805]  (hidden comment: R_0805)
R83  Footprint Index: C_0805  Type/Value: 6k8  [CAP-MLCC_0805]  (hidden comment: R_0805)
R84  Footprint Index: C_0805  Type/Value: 47k  [CAP-MLCC_0805]  (hidden comment: R_0805)
R85  Footprint Index: C_0805  Type/Value: 47k  [CAP-MLCC_0805]  (hidden comment: R_0805)
R86  Footprint Index: C_0805  Type/Value: 10k  [CAP-MLCC_0805]  (hidden comment: R_0805)
R87  Footprint Index: C_0805  Type/Value: 0R  [CAP-MLCC_0805]  (hidden comment: R_0805)
R88  Footprint Index: C_0805  Type/Value: 4R7  [CAP-MLCC_0805]  (hidden comment: R_0805)
R89  Footprint Index: C_0805  Type/Value: 10k  [CAP-MLCC_0805]  (hidden comment: R_0805)
R90  Footprint Index: C_0805  Type/Value: 100k  [CAP-MLCC_0805]  (hidden comment: R_0805)
R91  Footprint Index: C_0805  Type/Value: 0R  [CAP-MLCC_0805]  (hidden comment: R_0805)
R92  Footprint Index: C_0805  Type/Value: 5.6k  [CAP-MLCC_0805]  (hidden comment: R_0805)
R93  Footprint Index: C_0805  Type/Value: 1k  [CAP-MLCC_0805]  (hidden comment: R_0805)
R94  Footprint Index: C_0805  Type/Value: 1k  [CAP-MLCC_0805]  (hidden comment: R_0805)
R95  Footprint Index: C_0805  Type/Value: 5.6k  [CAP-MLCC_0805]  (hidden comment: R_0805)
R96  Footprint Index: C_0805  Type/Value: 1k  [CAP-MLCC_0805]  (hidden comment: R_0805)
R97  Footprint Index: C_0805  Type/Value: 5.6k  [CAP-MLCC_0805]  (hidden comment: R_0805)
R98  Footprint Index: C_0805  Type/Value: 1k  [CAP-MLCC_0805]  (hidden comment: R_0805)
R99  Footprint Index: C_0805  Type/Value: 5.6k  [CAP-MLCC_0805]  (hidden comment: R_0805)
R100  Footprint Index: C_0805  Type/Value: 1k  [CAP-MLCC_0805]  (hidden comment: R_0805)
R101  Footprint Index: C_0805  Type/Value: 5.6k  [CAP-MLCC_0805]  (hidden comment: R_0805)
R102  Footprint Index: C_0805  Type/Value: 1k  [CAP-MLCC_0805]  (hidden comment: R_0805)
R103  Footprint Index: C_0805  Type/Value: 5.6k  [CAP-MLCC_0805]  (hidden comment: R_0805)
R111  Type/Value: R100/1%  [RES_2512]  (hidden comment: R_2512)
R113  Type/Value: R100/1%  [RES_2512]  (hidden comment: R_2512)
R115  Footprint Index: C_0805  Type/Value: 100k  [CAP-MLCC_0805]  (hidden comment: R_0805)
R116  Footprint Index: C_0805  Type/Value: 2R2  [CAP-MLCC_0805]  (hidden comment: R_0805)
R117  Footprint Index: C_0805  Type/Value: 2k2  [CAP-MLCC_0805]  (hidden comment: R_0805)
R118  Footprint Index: C_0805  Type/Value: 620R  [CAP-MLCC_0805]  (hidden comment: R_0805)
R119  Footprint Index: C_0805  Type/Value: 680R  [CAP-MLCC_0805]  (hidden comment: R_0805)
R120  Footprint Index: C_0805  Type/Value: 22k  [CAP-MLCC_0805]  (hidden comment: R_0805)
R121  Footprint Index: C_0805  Type/Value: 2k2  [CAP-MLCC_0805]  (hidden comment: R_0805)
R131  Type/Value: R100/1%  [RES_2512]  (hidden comment: R_2512)
R133  Type/Value: R100/1%  [RES_2512]  (hidden comment: R_2512)
R135  Footprint Index: C_0805  Type/Value: 100k  [CAP-MLCC_0805]  (hidden comment: R_0805)
R136  Footprint Index: C_0805  Type/Value: 2R2  [CAP-MLCC_0805]  (hidden comment: R_0805)
R137  Footprint Index: C_0805  Type/Value: 2k2  [CAP-MLCC_0805]  (hidden comment: R_0805)
R138  Footprint Index: C_0805  Type/Value: 620R  [CAP-MLCC_0805]  (hidden comment: R_0805)
R139  Footprint Index: C_0805  Type/Value: 680R  [CAP-MLCC_0805]  (hidden comment: R_0805)
R140  Footprint Index: C_0805  Type/Value: 22k  [CAP-MLCC_0805]  (hidden comment: R_0805)
R141  Footprint Index: C_0805  Type/Value: 2k2  [CAP-MLCC_0805]  (hidden comment: R_0805)
R151  Type/Value: R100/1%  [RES_2512]  (hidden comment: R_2512)
R153  Type/Value: R100/1%  [RES_2512]  (hidden comment: R_2512)
R155  Footprint Index: C_0805  Type/Value: 100k  [CAP-MLCC_0805]  (hidden comment: R_0805)
R156  Footprint Index: C_0805  Type/Value: 2R2  [CAP-MLCC_0805]  (hidden comment: R_0805)
R157  Footprint Index: C_0805  Type/Value: 2k2  [CAP-MLCC_0805]  (hidden comment: R_0805)
R158  Footprint Index: C_0805  Type/Value: 620R  [CAP-MLCC_0805]  (hidden comment: R_0805)
R159  Footprint Index: C_0805  Type/Value: 680R  [CAP-MLCC_0805]  (hidden comment: R_0805)
R160  Footprint Index: C_0805  Type/Value: 22k  [CAP-MLCC_0805]  (hidden comment: R_0805)
R161  Footprint Index: C_0805  Type/Value: 2k2  [CAP-MLCC_0805]  (hidden comment: R_0805)
R171  Type/Value: R100/1%  [RES_2512]  (hidden comment: R_2512)
R173  Type/Value: R100/1%  [RES_2512]  (hidden comment: R_2512)
R175  Footprint Index: C_0805  Type/Value: 100k  [CAP-MLCC_0805]  (hidden comment: R_0805)
R176  Footprint Index: C_0805  Type/Value: 2R2  [CAP-MLCC_0805]  (hidden comment: R_0805)
R177  Footprint Index: C_0805  Type/Value: 2k2  [CAP-MLCC_0805]  (hidden comment: R_0805)
R178  Footprint Index: C_0805  Type/Value: 620R  [CAP-MLCC_0805]  (hidden comment: R_0805)
R179  Footprint Index: C_0805  Type/Value: 680R  [CAP-MLCC_0805]  (hidden comment: R_0805)
R180  Footprint Index: C_0805  Type/Value: 22k  [CAP-MLCC_0805]  (hidden comment: R_0805)
R181  Footprint Index: C_0805  Type/Value: 2k2  [CAP-MLCC_0805]  (hidden comment: R_0805)
R191  Type/Value: R100/1%  [RES_2512]  (hidden comment: R_2512)
R193  Type/Value: R100/1%  [RES_2512]  (hidden comment: R_2512)
R195  Footprint Index: C_0805  Type/Value: 100k  [CAP-MLCC_0805]  (hidden comment: R_0805)
R196  Footprint Index: C_0805  Type/Value: 2R2  [CAP-MLCC_0805]  (hidden comment: R_0805)
R197  Footprint Index: C_0805  Type/Value: 2k2  [CAP-MLCC_0805]  (hidden comment: R_0805)
R198  Footprint Index: C_0805  Type/Value: 620R  [CAP-MLCC_0805]  (hidden comment: R_0805)
R199  Footprint Index: C_0805  Type/Value: 680R  [CAP-MLCC_0805]  (hidden comment: R_0805)
R200  Footprint Index: C_0805  Type/Value: 22k  [CAP-MLCC_0805]  (hidden comment: R_0805)
R201  Footprint Index: C_0805  Type/Value: 2k2  [CAP-MLCC_0805]  (hidden comment: R_0805)
RN1  Type/Value: 4.7k±1%  [RES_0204]  (hidden comment: R_0204)
RN2  Type/Value: 4.7k±1%  [RES_0204]  (hidden comment: R_0204)
RN3  Type/Value: 4.7k±1%  [RES_0204]  (hidden comment: R_0204)
RN4  Type/Value: 4.7k±1%  [RES_0204]  (hidden comment: R_0204)
RV1  SubClass: R-RV  Type/Value: 20k  [BOURNS 3296W]  (hidden comment: R-RV_3296W)
RV2  SubClass: R-RV  Type/Value: 20k  [BOURNS 3296W]  (hidden comment: R-RV_3296W)
RV3  SubClass: R-RV  Type/Value: 20k  [BOURNS 3296W]  (hidden comment: R-RV_3296W)
RV4  SubClass: R-RV  Type/Value: 20k  [BOURNS 3296W]  (hidden comment: R-RV_3296W)
RV5  SubClass: R-RV  Type/Value: 20k  [BOURNS 3296W]  (hidden comment: R-RV_3296W)
S1  Footprint Index: 4.5X4.5X1.6  Class: SW  [SW_4.5X4.5X1.6]  (hidden comment: SW_4.5X4.5X1.6)
S2  Footprint Index: 4.5X4.5X1.6  Class: SW  [SW_4.5X4.5X1.6]  (hidden comment: SW_4.5X4.5X1.6)
S3  Footprint Index: DT-SIP_6X6X7  Class: SW  [SW-DT-SIP_6X6X7]  (hidden comment: SW-DT-SIP_6X6X7)
SL1  Footprint Index: XH2.54A  Class: HDR  [HDR-XH2.54A_8P]  (hidden comment: HDR-XH2.54A_8P)
SW1  Footprint Index: DSHP-1.27_04  Class: SW  Manufacturer: KE  [KE DSHP-1.27_04]  (hidden comment: SW_DSHP-1.27_04)
SW2  Footprint Index: DSHP-1.27_04  Class: SW  Manufacturer: KE  [KE DSHP-1.27_04]  (hidden comment: SW_DSHP-1.27_04)
SW3  Footprint Index: DSHP-1.27_04  Class: SW  Manufacturer: KE  [KE DSHP-1.27_04]  (hidden comment: SW_DSHP-1.27_04)
SW4  Footprint Index: DSHP-1.27_04  Class: SW  Manufacturer: KE  [KE DSHP-1.27_04]  (hidden comment: SW_DSHP-1.27_04)
SW5  Footprint Index: DSHP-1.27_04  Class: SW  Manufacturer: KE  [KE DSHP-1.27_04]  (hidden comment: SW_DSHP-1.27_04)
TVS1  SubClass: Diode-TVS  Type/Value: SR05.TC  [SOT-143]  (hidden comment: Diode-TVS_SOT-143)
U1  Footprint Index: TF Card_SPI Mode  Class: Slot  [Slot-TF Card]  (hidden comment: Slot-TF Card_SPI Mode)
U10  Type: N532  [SOT23-5]  (hidden comment: IC-N532)
U15  Type: N532  [SOT23-5]  (hidden comment: IC-N532)
U16  Type: N532  [SOT23-5]  (hidden comment: IC-N532)
U111  Type: TMC2226  [TSSOP-28_173MIL-0.65-EP]  (hidden comment: IC-TMC2226)
U131  Type: TMC2226  [TSSOP-28_173MIL-0.65-EP]  (hidden comment: IC-TMC2226)
U151  Type: TMC2226  [TSSOP-28_173MIL-0.65-EP]  (hidden comment: IC-TMC2226)
U171  Type: TMC2226  [TSSOP-28_173MIL-0.65-EP]  (hidden comment: IC-TMC2226)
U191  Type: TMC2226  [TSSOP-28_173MIL-0.65-EP]  (hidden comment: IC-TMC2226)
X1  Footprint Index: XH2.54A  Class: HDR  [HDR-XH2.54A_4P]  (hidden comment: HDR-XH2.54A_4P)
X2  Footprint Index: XH2.54A  Class: HDR  [HDR-XH2.54A_4P]  (hidden comment: HDR-XH2.54A_4P)
X3  Footprint Index: XH2.54A  Class: HDR  [HDR-XH2.54A_4P]  (hidden comment: HDR-XH2.54A_4P)
X4  Footprint Index: XH2.54A  Class: HDR  [HDR-XH2.54A_4P]  (hidden comment: HDR-XH2.54A_4P)
X5  Footprint Index: XH2.54A  Class: HDR  [HDR-XH2.54A_4P]  (hidden comment: HDR-XH2.54A_4P)
X7  Footprint Index: XH2.54A  Class: HDR  [HDR-XH2.54A_2P]  (hidden comment: HDR-XH2.54A_2P)
X8  Footprint Index: XH2.54A  Class: HDR  [HDR-XH2.54A_2P]  (hidden comment: HDR-XH2.54A_2P)
X9  Footprint Index: XH2.54A  Class: HDR  [HDR-XH2.54A_2P]  (hidden comment: HDR-XH2.54A_2P)
X10  Footprint Index: 2EDGRC-3.81  Class: HDR  [HDR-2EDGRC-3.81_2P]  (hidden comment: HDR-2EDGRC-3.81_2P)
X11  Footprint Index: KF301-5.0  Class: HDR  [HDR-KF301-5.0_2P]  (hidden comment: HDR-KF301-5.0_2P)
X12  Footprint Index: 2EDGRC-3.81  Class: HDR  [HDR-2EDGRC-3.81_2P]  (hidden comment: HDR-2EDGRC-3.81_2P)
X14  Footprint Index: USB3.0_Type_A  Manufacturer: Farmertek  Class: HDR  [HDR-FARMERTEK USB3.0_TYPE_A]  (hidden comment: HDR-Farmertek USB3.0_Type_A)
X15  Footprint Index: 2EDGRC-3.81  Class: HDR  [HDR-2EDGRC-3.81_2P]  (hidden comment: HDR-2EDGRC-3.81_2P)
X16  Footprint Index: 2EDGRC-3.81  Class: HDR  [HDR-2EDGRC-3.81_2P]  (hidden comment: HDR-2EDGRC-3.81_2P)

## Nets
3V3: C1.1 C7.1 C8.1 C9.1 C10.1 C11.1 C12.1 C13.1 C14.1 C65.1 C67.1 CP1.1 IC1.19(VBAT) IC1.28(VDD(3V3)) IC1.42(VDD(REG)(3V3)) IC1.54(VDD(3V3)) IC1.71(VDD(3V3)) IC1.84(VDD(REG)(3V3)) IC1.96(VDD(3V3)) IC10.2(Vout) IC10.4(Vout) JP1.2 JP2.1 JP8.1 JP32.1 L1.1 Q1.2(S) R1.1 R2.2 R3.1 R5.1 R6.1 R14.1 R15.2 R16.2 R17.1 R35.1 R36.1 R77.1 U1.4(VDD)
5V: C64.1 C84.1 C85.1 C86.1 D1.2(K) D2.2(K) IC10.3(Vin) JP5.1 JP14.1 JP16.1 JP19.1 JP21.1 JP22.1 JP26.1 JP36.1 R86.2 R93.1 R94.1 R96.1 R98.1 R100.1 R102.1 U10.1(VCC) U10.4(EN) U15.1(VCC) U15.4(EN) U16.1(VCC) U16.4(EN)
24V: C111.1 C112.2 C113.1 C115.2 C116.1 C119.1 C131.1 C132.2 C133.1 C135.2 C136.1 C139.1 C151.1 C152.2 C153.1 C155.2 C156.1 C159.1 C171.1 C172.2 C173.1 C175.2 C176.1 C179.1 C192.2 C193.1 C195.2 C196.1 C199.1 D7.2(K) D8.2(K) D9.2(K) D10.2(K) D15.2(K) D16.2(K) R65.2 R66.2 R67.2 R68.2 R78.2 R84.2 R85.2 R89.2 U111.3(VS) U111.26(VS) U131.3(VS) U131.26(VS) U151.3(VS) U151.26(VS) U171.3(VS) U171.26(VS) U191.3(VS) U191.26(VS) X7.1 X8.1 X9.1 X10.1 X11.1 X15.1 X16.1
+5V: D2.1(A) X12.1
AGND: C6.2 C21.2 C22.2 C23.2 C24.2 IC1.11(VSSA) IC1.15(VREFN) JP35.2 R87.1 SL1.1 SL1.3 SL1.5 SL1.7
AVCC: C6.1 IC1.10(VDDA) IC1.12(VREFP) JP35.1 L1.2 RN1.2 RN2.2 RN3.2 RN4.2
GND: C1.2 C2.1 C3.1 C4.2 C5.2 C7.2 C8.2 C9.2 C10.2 C11.2 C12.2 C13.2 C14.2 C64.2 C65.2 C67.2 C78.2 C79.2 C80.2 C81.2 C82.2 C83.2 C84.2 C85.2 C86.2 CP1.2 IC1.31(VSS) IC1.41(VSS) IC1.55(VSS) IC1.72(VSS) IC1.83(VSS) IC1.97(VSS) IC10.1(GND) JP1.1 JP1.4 JP2.6 JP5.2 JP7.4 JP8.2 JP9.4 JP12.4 JP14.2 JP15.4 JP16.2 JP18.4 JP19.2 JP21.2 JP22.2 JP23.2 JP25.2 JP26.2 JP27.2 JP32.2 JP36.2 LED1.2(K) LED2.2(K) LED3.2(K) LED4.2(K) LED9.2(K) R87.2 R91.2 S1.1 S2.1 S3.1 TVS1.1 U1.6(VSS) U1.9(Cd) U1.10(SHIELD) U10.2(GND) U15.2(GND) U16.2(GND) X12.2 X14.0(GND) X14.4(GND)
PGND: C63.1 C111.2 C112.1 C113.2 C114.1 C115.1 C116.2 C117.2 C120.2 C121.2 C122.2 C123.2 C124.2 C125.2 C126.2 C131.2 C132.1 C133.2 C134.1 C135.1 C136.2 C137.2 C140.2 C141.2 C142.2 C143.2 C144.2 C145.2 C146.2 C151.2 C152.1 C153.2 C154.1 C155.1 C156.2 C157.2 C160.2 C161.2 C162.2 C163.2 C164.2 C165.2 C166.2 C171.2 C172.1 C173.2 C174.1 C175.1 C176.2 C177.2 C180.2 C181.2 C182.2 C183.2 C184.2 C185.2 C186.2 C192.1 C193.2 C194.1 C195.1 C196.2 C197.2 C200.2 C201.2 C202.2 C203.2 C204.2 C205.2 C206.2 D5.1(A) J111.2 J131.2 J151.2 J171.2 J191.2 LED10.2(K) Q4.2(S) Q5.3(S) Q6.3(S) Q7.3(S) Q8.2(S) Q9.2(S) Q10.3(S) R74.1 R76.1 R83.1 R90.1 R91.1 R111.1 R113.2 R115.2 R121.1 R131.1 R133.2 R135.2 R141.1 R151.1 R153.2 R155.2 R161.1 R171.1 R173.2 R175.2 R181.1 R191.1 R193.2 R195.2 R201.1 U111.0(EPAD) U111.6(GND) U111.13(NC) U111.17(CLK) U111.22(GND) U131.0(EPAD) U131.6(GND) U131.13(NC) U131.17(CLK) U131.22(GND) U151.0(EPAD) U151.6(GND) U151.13(NC) U151.17(CLK) U151.22(GND) U171.0(EPAD) U171.6(GND) U171.13(NC) U171.17(CLK) U171.22(GND) U191.0(EPAD) U191.6(GND) U191.13(NC) U191.17(CLK) U191.22(GND)
VUSB: D1.1(A) X14.1(VBUS)
5VOUT1: C120.1 C121.1 R116.1 R117.2 SW1.1 SW1.3 SW1.5 SW1.7 U111.11(5VOUT) U111.19(VCC_IO)  [also labelled VCC_IO1]
5VOUT3: C140.1 C141.1 R136.1 R137.2 SW2.1 SW2.3 SW2.5 SW2.7 U131.11(5VOUT) U131.19(VCC_IO)  [also labelled VCC_IO3]
5VOUT5: C160.1 C161.1 R156.1 R157.2 SW3.1 SW3.3 SW3.5 SW3.7 U151.11(5VOUT) U151.19(VCC_IO)  [also labelled VCC_IO5]
5VOUT7: C180.1 C181.1 R176.1 R177.2 SW4.1 SW4.3 SW4.5 SW4.7 U171.11(5VOUT) U171.19(VCC_IO)  [also labelled VCC_IO7]
5VOUT9: C200.1 C201.1 R196.1 R197.2 SW5.1 SW5.3 SW5.5 SW5.7 U191.11(5VOUT) U191.19(VCC_IO)  [also labelled VCC_IO9]
DIR1: IC1.80(P0[5]/I2SRX_WS/TD2/CAP2[1]) JP7.2 U111.23(DIR)
DIR2: IC1.49(P0[11]/RXD2/SCL2/MAT3[1]) JP9.2 U131.23(DIR)
DIR3: IC1.58(P0[20]/DTR1/SCL1) JP12.2 U151.23(DIR)
DIR4: IC1.56(P0[22]/RTS1/TD1) JP15.2 U171.23(DIR)
DIR5: IC1.50(P2[13]/~{EINT3}/I2STX_SDA) JP18.2 U191.23(DIR)
EN1: IC1.81(P0[4]/I2SRX_CLK/RD2/CAP2[0]) JP7.1 U111.5(ENN)
EN2: IC1.48(P0[10]/TXD2/SDA2/MAT3[0]) JP9.1 U131.5(ENN)
EN3: IC1.59(P0[19]/DSR1/SDA1) JP12.1 U151.5(ENN)
EN4: IC1.57(P0[21]/RI1/RD1) JP15.1 U171.5(ENN)
EN5: IC1.85(P4[29]/TX_MCLK/MAT2[1]/RXD3) JP18.1 U191.5(ENN)
ENET_CRS: IC1.92(P1[8]/ENET_CRS)
ENET_MDC: IC1.87(P1[16]/ENET_MDC)
ENET_MDIO: IC1.86(P1[17]/ENET_MDIO)
ENET_REF_CLK: IC1.88(P1[15]/ENET_REF_CLK)
ENET_RX_ER: IC1.89(P1[14]/ENET_RX_ER)
ENET_RXD0: IC1.91(P1[9]/ENET_RXD0)
ENET_RXD1: IC1.90(P1[10]/ENET_RXD1)
ENET_TX_EN: IC1.93(P1[4]/ENET_TX_EN)
ENET_TXD0: IC1.95(P1[0]/ENET_TXD0)
ENET_TXD1: IC1.94(P1[1]/ENET_TXD1)
ISP_BOOT: IC1.53(P2[10]/~{EINT0}/NMI) JP27.1 R15.1 S2.2
JTAG_RTCK: IC1.100(RTCK)
JTAG_TCK: IC1.5(TCK/SWDCLK)
JTAG_TDI: IC1.2(TDI)
JTAG_TDO: IC1.1(TDO/SWO)
JTAG_TMS: IC1.3(TMS/SWDIO)
JTAG_TRST: IC1.4(~{TRST})
LED1: IC1.32(P1[18]/USB_UP_LED/PWM1[1]/CAP1[0]) R10.2
LED2: IC1.33(P1[19]/MCOA0/USB_PPWR/CAP1[1]) R11.2
LED3: IC1.34(P1[20]/MCI0/PWM1[2]/SCK0) R12.2
LED4: IC1.35(P1[21]/~{MCABORT}/PWM1[3]/SSEL0) R13.2
MISO1: IC1.61(P0[17]/CTS1/MISO0/MISO) JP2.3
MOSI1: IC1.60(P0[18]/DCD1/MOSI0/MOSI) JP2.2
MS11: SW1.4 U111.12(MS1_AD0)
MS12: SW1.2 U111.14(MS2_AD1)
MS31: SW2.4 U131.12(MS1_AD0)
MS32: SW2.2 U131.14(MS2_AD1)
MS51: SW3.4 U151.12(MS1_AD0)
MS52: SW3.2 U151.14(MS2_AD1)
MS71: SW4.4 U171.12(MS1_AD0)
MS72: SW4.2 U171.14(MS2_AD1)
MS91: SW5.4 U191.12(MS1_AD0)
MS92: SW5.2 U191.14(MS2_AD1)
OA11: C125.1 U111.28(OA1) X1.3
OA12: C126.1 U111.25(OA2) X1.4
OA31: C145.1 U131.28(OA1) X2.3
OA32: C146.1 U131.25(OA2) X2.4
OA51: C165.1 U151.28(OA1) X3.3
OA52: C166.1 U151.25(OA2) X3.4
OA71: C185.1 U171.28(OA1) X4.3
OA72: C186.1 U171.25(OA2) X4.4
OA91: C205.1 U191.28(OA1) X5.3
OA92: C206.1 U191.25(OA2) X5.4
OB11: C124.1 U111.1(OB1) X1.2
OB12: C123.1 U111.4(OB2) X1.1
OB31: C144.1 U131.1(OB1) X2.2
OB32: C143.1 U131.4(OB2) X2.1
OB51: C164.1 U151.1(OB1) X3.2
OB52: C163.1 U151.4(OB2) X3.1
OB71: C184.1 U171.1(OB1) X4.2
OB72: C183.1 U171.4(OB2) X4.1
OB91: C204.1 U191.1(OB1) X5.2
OB92: C203.1 U191.4(OB2) X5.1
P1_22: IC1.36(P1[22]/MCOB0/USB_PWRD/MAT1[0]) R82.2
P1_23: IC1.37(P1[23]/MCI1/PWM1[4]/MISO0) U16.5(IN)
P1_30: IC1.21(P1[30]/VBUS/AD0[4]) JP32.3
P1_31: IC1.20(P1[31]/SCK1/AD0[5]) JP32.4
P2.6: IC1.67(P2[6]/PCAP1[0]/RI1/TRACECLK) R75.2
P2.7: IC1.66(P2[7]/RD2/RTS1) U15.5(IN)
P2.9: IC1.64(P2[9]/USB_CONNECT/RXD2) Q1.1(G)
PDN_UART1: SW1.6 U111.18(PDN_UART)
PDN_UART3: SW2.6 U131.18(PDN_UART)
PDN_UART5: SW3.6 U151.18(PDN_UART)
PDN_UART7: SW4.6 U171.18(PDN_UART)
PDN_UART9: SW5.6 U191.18(PDN_UART)
PLAY: IC1.51(P2[12]/~{EINT2}/I2STX_WS) JP23.1 R16.1 S3.2
PLAY_LED: IC1.82(P4[28]/RX_MCLK/MAT2[0]/TXD3) JP24.1 PLAY_LED.2(K)
POT_SCL: IC1.47(P0[1]/TD1/RXD3/SCL1) JP8.3 R36.2
POT_SDA: IC1.46(P0[0]/RD1/TXD3/SDA1) JP8.4 R35.2
PWM0: IC1.69(P2[4]/PWM1[5]/DSR1/TRACEDATA[1]) R73.2
PWM1: IC1.68(P2[5]/PWM1[6]/DTR1/TRACEDATA[0]) U10.5(IN)
RESET: IC1.17(~{RESET}) JP25.1 R14.2 S1.2
RSTOUT: IC1.14(~{RSTOUT})
RX_0: IC1.99(P0[3]/RXD0/AD0[6]) JP5.4
SCK1: IC1.62(P0[15]/TXD1/SCK0/SCK) JP2.4
SCL: IC1.24(P0[28]/SCL0/USB_SCL) JP1.8 R5.2
SD_CD: IC1.52(P2[11]/~{EINT1}/I2STX_CLK) JP1.7
SD_CS: IC1.79(P0[6]/I2SRX_SDA/SSEL1/MAT2[0]) R1.2 U1.2(CS)
SD_IRQ: IC1.27(P3[25]/MAT0[0]/PWM1[2]) JP1.3
SD_MISO: IC1.77(P0[8]/I2STX_WS/MISO1/MAT2[2]) R2.1 U1.7(DO)
SD_MOSI: IC1.76(P0[9]/I2STX_SDA/MOSI1/MAT2[3]) R3.2 U1.3(DI)
SD_SCK: IC1.78(P0[7]/I2STX_CLK/SCK1/MAT2[1]) U1.5(SCLK)
SD_WP: IC1.26(P3[26]/STCLK/MAT0[1]/PWM1[3]) JP1.5
SDA: IC1.25(P0[27]/SDA0/USB_SDA) JP1.6 R6.2
SPREAD1: SW1.8 U111.10(SPREAD)
SPREAD3: SW2.8 U131.10(SPREAD)
SPREAD5: SW3.8 U151.10(SPREAD)
SPREAD7: SW4.8 U171.10(SPREAD)
SPREAD9: SW5.8 U191.10(SPREAD)
SSEL1: IC1.63(P0[16]/RXD1/SSEL0/SSEL) JP2.5
STEP1: IC1.75(P2[0]/PWM1[1]/TXD1) JP7.3 U111.20(STEP)
STEP2: IC1.74(P2[1]/PWM1[2]/RXD1) JP9.3 U131.20(STEP)
STEP3: IC1.73(P2[2]/PWM1[3]/CTS1/TRACEDATA[3]) JP12.3 U151.20(STEP)
STEP4: IC1.70(P2[3]/PWM1[4]/DCD1/TRACEDATA[2]) JP15.3 U171.20(STEP)
STEP5: IC1.65(P2[8]/TD2/TXD2) JP18.3 U191.20(STEP)
TH1: C21.1 IC1.9(P0[23]/AD0[0]/I2SRX_CLK/CAP3[0]) RN1.1 SL1.2
TH2: C22.1 IC1.8(P0[24]/AD0[1]/I2SRX_WS/CAP3[1]) RN2.1 SL1.4
TH3: C23.1 IC1.7(P0[25]/AD0[2]/I2SRX_SDA/TXD3) RN3.1 SL1.6
TH4: C24.1 IC1.6(P0[26]/AD0[3]/AOUT/RXD3) RN4.1 SL1.8
TX_0: IC1.98(P0[2]/TXD0/AD0[7]) JP5.3
USB_DATA_N: C4.1 IC1.30(P0[30]/USB_D-) R9.2
USB_DATA_P: C5.1 IC1.29(P0[29]/USB_D+) R7.1 R8.2
VREF1: R119.1 R120.1 RV1.2 RV1.3 U111.21(VREF)
VREF3: R139.1 R140.1 RV2.2 RV2.3 U131.21(VREF)
VREF5: R159.1 R160.1 RV3.2 RV3.3 U151.21(VREF)
VREF7: R179.1 R180.1 RV4.2 RV4.3 U171.21(VREF)
VREF9: R199.1 R200.1 RV5.2 RV5.3 U191.21(VREF)
X_MAX: C79.1 IC1.39(P1[25]/MCOA1/MAT1[1]) R95.2
X_MIN: C78.1 IC1.38(P1[24]/MCI2/PWM1[5]/MOSI0) R92.2
Y_MAX: C81.1 IC1.43(P1[27]/CLKOUT/~{USB_OVRCR}/CAP0[1]) R99.2
Y_MIN: C80.1 IC1.40(P1[26]/MCOB1/PWM1[6]/CAP0[0]) R97.2
Z_MAX: C83.1 IC1.45(P1[29]/MCOB2/PCAP1[1]/MAT0[1]) R103.2
Z_MIN: C82.1 IC1.44(P1[28]/MCOA2/PCAP1[0]/MAT0[0]) R101.2
NetC2_2: C2.2 IC1.22(XTAL1) Q2.2(OSC2)
NetC3_2: C3.2 IC1.23(XTAL2) Q2.1(OSC1)
NetC63_2: C63.2 D5.2(K) Q10.1(G) R89.1 R90.2
NetC114_2: C114.2 R111.2 U111.2(BRB)
NetC117_1: C117.1 R113.1 U111.27(BRA)
NetC118_1: C118.1 U111.7(CPO)
NetC118_2: C118.2 U111.8(CPI)
NetC119_2: C119.2 U111.9(VCP)
NetC122_1: C122.1 R116.2
NetC134_2: C134.2 R131.2 U131.2(BRB)
NetC137_1: C137.1 R133.1 U131.27(BRA)
NetC138_1: C138.1 U131.7(CPO)
NetC138_2: C138.2 U131.8(CPI)
NetC139_2: C139.2 U131.9(VCP)
NetC142_1: C142.1 R136.2
NetC154_2: C154.2 R151.2 U151.2(BRB)
NetC157_1: C157.1 R153.1 U151.27(BRA)
NetC158_1: C158.1 U151.7(CPO)
NetC158_2: C158.2 U151.8(CPI)
NetC159_2: C159.2 U151.9(VCP)
NetC162_1: C162.1 R156.2
NetC174_2: C174.2 R171.2 U171.2(BRB)
NetC177_1: C177.1 R173.1 U171.27(BRA)
NetC178_1: C178.1 U171.7(CPO)
NetC178_2: C178.2 U171.8(CPI)
NetC179_2: C179.2 U171.9(VCP)
NetC182_1: C182.1 R176.2
NetC194_2: C194.2 R191.2 U191.2(BRB)
NetC197_1: C197.1 R193.1 U191.27(BRA)
NetC198_1: C198.1 U191.7(CPO)
NetC198_2: C198.2 U191.8(CPI)
NetC199_2: C199.2 U191.9(VCP)
NetC202_1: C202.1 R196.2
NetD7_1: D7.1(A) LED5.2(K) Q8.3(D) X7.2
NetD8_1: D8.1(A) LED6.2(K) Q9.3(D) X8.2
NetD9_1: D9.1(A) LED11.2(K) Q4.3(D) X9.2
NetD10_1: D10.1(A) LED7.2(K) Q6.4(D) X10.2
NetD15_1: D15.1(A) LED8.2(K) Q7.4(D) X15.2
NetD16_1: D16.1(A) LED12.2(K) Q5.4(D) X16.2
NetJ111_1: J111.1 R119.2 R120.2 R121.2
NetJ131_1: J131.1 R139.2 R140.2 R141.2
NetJ151_1: J151.1 R159.2 R160.2 R161.2
NetJ171_1: J171.1 R179.2 R180.2 R181.2
NetJ191_1: J191.1 R199.2 R200.2 R201.2
NetJP14_3: JP14.3 R94.2 R95.1
NetJP16_3: JP16.3 R96.2 R97.1
NetJP19_3: JP19.3 R98.2 R99.1
NetJP21_3: JP21.3 R100.2 R101.1
NetJP22_3: JP22.3 R102.2 R103.1
NetJP24_2: JP24.2 R17.2
NetJP24_3: JP24.3 PLAY_LED.1(A)
NetJP26_3: JP26.3 R92.1 R93.2
NetLED1_1: LED1.1(A) R10.1
NetLED2_1: LED2.1(A) R11.1
NetLED3_1: LED3.1(A) R12.1
NetLED4_1: LED4.1(A) R13.1
NetLED5_1: LED5.1(A) R65.1
NetLED6_1: LED6.1(A) R66.1
NetLED7_1: LED7.1(A) R67.1
NetLED8_1: LED8.1(A) R68.1
NetLED9_1: LED9.1(A) R77.2
NetLED10_1: LED10.1(A) R78.1
NetLED11_1: LED11.1(A) R84.1
NetLED12_1: LED12.1(A) R85.1
NetQ1_3: Q1.3(D) R7.2
NetQ4_1: Q4.1(G) R82.1 R83.2
NetQ5_1: Q5.1(G) R88.1
NetQ6_1: Q6.1(G) R69.1
NetQ7_1: Q7.1(G) R70.1
NetQ8_1: Q8.1(G) R73.1 R74.2
NetQ9_1: Q9.1(G) R75.1 R76.2
NetQ10_4: Q10.4(D) X11.2
NetR8_1: R8.1 TVS1.3 X14.3(D+)
NetR9_1: R9.1 TVS1.2 X14.2(D-)
NetR69_2: R69.2 U10.3(OUT)
NetR70_2: R70.2 U15.3(OUT)
NetR86_1: R86.1 TVS1.4
NetR88_2: R88.2 U16.3(OUT)
NetR115_1: R115.1 U111.24(STDBY)
NetR117_1: R117.1 R118.2
NetR118_1: R118.1 RV1.1
NetR135_1: R135.1 U131.24(STDBY)
NetR137_1: R137.1 R138.2
NetR138_1: R138.1 RV2.1
NetR155_1: R155.1 U151.24(STDBY)
NetR157_1: R157.1 R158.2
NetR158_1: R158.1 RV3.1
NetR175_1: R175.1 U171.24(STDBY)
NetR177_1: R177.1 R178.2
NetR178_1: R178.1 RV4.1
NetR195_1: R195.1 U191.24(STDBY)
NetR197_1: R197.1 R198.2
NetR198_1: R198.1 RV5.1

Not connected (* = marked no-connect by the designer): IC1 13(N.C.) 16(RTCX1) 18(RTCX2); U1 1(RSV)* 8(RSV)*; U111 15(DIAG) 16(INDEX); U131 15(DIAG) 16(INDEX); U151 15(DIAG) 16(INDEX); U171 15(DIAG) 16(INDEX); U191 15(DIAG) 16(INDEX); X14 5(USB3.0_Receive-) 6(USB3.0_Receive+) 7(GND) 8(USB3.0_Transmit-) 9(USB3.0_Transmit+)

## Layout directives
differential pair: USB_DATA_N, USB_DATA_P

## Notes on the sheet
- (near R77) 原1k
- (near JP36) 自己加的，5V输出引脚
- 原3k3
- (near LED9) Red
- Red
- (near D5) 12V
- 吸收尖峰电压
- 保护MOS管
- (near LED10) Red
- 原10k
- 原2k2
- MOS管导通后DS间理论上能通交流
- 刚上电时MOS管不导通，需要利用体二极管构成回路
- 防反接电路
- (near U10) 3-5v工作，0v关
- (near U10) 输入阻抗15k
- (near Q6) N532内置了8k的下拉电阻，Rgs省略
- 将原理图中TF卡SPI引出脚JP4、JP6删除
- (near R17) 原330R
- 官方原理图中供电电压可以通过转焊焊盘选择3V3
- (near PLAY_LED) Red
- 默认连接的是5V
- (near JP5) 官方原理图中CTS、RTS是空的，删除，改成4脚引出
- Cd：插入检测脚。TF卡完全插入后，为低电平。
- 删除JP13:混合MOSFET输入选择（从VBB获取电源）跳线。必须镀金或黄铜（>5A）
- (near JP5) UART0(同时用作ISP下载)
- (near JP5) UART\串口引出脚
- 所有大小MOSFET控制引脚的引出脚
- 设计用于控制气泵、LED补光灯（OpenPnP）
- 热床、打印头加热、风扇（3D打印机）
- (near SL1) 热敏电阻输入接口
- PWM1：大MOSFET控制引脚
- P2.7：大MOSFET控制引脚
- JP10——MOSFET控制引脚的地，删除
- JP33删除
- P1_22：小MOSFET控制引脚
- (near R87) 增加0Ω电阻，温度探头的模拟地和电源地单点接地
- SPI引出脚
- 将原理图中JP2、JP3合并了
- SPI所有通信线都是单端信号，它们的高低电平都是相对GND的电压差，所有设备需要共地。
- 如果从机没有独立供电，主机需要额外引出电源正极VCC给从机供电。
- (near C2) 官方原理图是12pF
- (near C3) 官方原理图是12pF
- 官方原理图是把JP25、JP27合在一起
- 官方原理图中上拉电压可以选择5V
- 默认连接的是3.3V
- 硬件学堂——IIC信号为什么要加上拉电阻
- (near JP23) 官方原理图是把PLAY和PLAY_LED合在一起
- 主电源引出脚删除
- (near JP1) I2C1引出脚
- (near R7) C4、C5官方原理图是18pF
- 限位开关的供电电压官方原理图中可以通过转焊焊盘选择3V3
- (near R93) 默认连接的是5V
- (near JP1) 将JP1和JP20合并
- (near JP1) 引脚序号有更改
- P1_30：大MOSFET控制引脚
- PWM0：小MOSFET控制引脚
- P2.6：小MOSFET控制引脚
- 增加TVS保护二极管
- I2C 2引出脚
- (near R10) 原1k
- (near LED1) Green
- (near LED2) Green
- (near R11) 原1k
- (near LED3) Green
- (near R12) 原1k
- (near LED4) Green
- 连接PCF8574控制8个电磁阀
- 引脚序号有更改
- 首选机械限位开关，常闭点接2、3引脚
- JP29——四个debug led的引出脚删除

## Library data of the parts
C1-C6 C8-C14 C63 C65 C67 C78-C86 C113 C114 C116-C126 C133 C134 C136-C146 C153 C154 C156-C166 C173 C174 C176-C186 C193 C194 C196-C206 = C-MLCC_0805: 贴片电容
C7 C64 CP1 = C-TAN_Type_B: 贴片钽电容
C21-C24 C112 C115 C132 C135 C152 C155 C172 C175 C192 C195 = C-MLCC_1210: 贴片电容
C111 C131 C151 C171 = C-EC-SIP_D10-5: 直插电解电容
D1 D2 D7-D9 = Diode-Schottky_SMA: 肖特基二极管
D5 = Diode-Zener_SOD-123: 贴片稳压二极管
D10 D15 D16 = Diode-Schottky_SMB: 肖特基二极管
IC1 = MCU-LPC176x: 微控制器
IC10 = LDO-AMS1117-3.3: 3.3V稳压芯片
J111 J131 J151 J171 J191 JP23 JP25 JP27 JP35 JP36 = Pin-2.54_1x2: 直插针-2.54
JP1 = Pin-2.54_2x4: 直插针-2.54
JP2 = Pin-2.54_1x6: 直插针-2.54
JP5 JP7-JP9 JP12 JP15 JP18 JP32 = Pin-2.54_1x4: 直插针-2.54
JP14 JP16 JP19 JP21 JP22 JP26 = HDR-XH2.54A_3P: XH2.54直针插座
JP24 = Pin-2.54_1x3: 直插针-2.54
L1 = L_0805: 贴片电感
LED1-LED12 PLAY_LED = LED_1206: 贴片LED
Q1 = MOSFET-P_SOT-23: 场效应管
Q2 = XTAL_5032: 贴片晶振
Q4 Q8 Q9 = MOSFET-N_SOT-23: 场效应管
Q5-Q7 Q10 = MOSFET-N_TO-252-3: 功率场效应管
R1-R3 R5-R17 R35 R36 R65-R70 R73-R78 R82-R103 R115-R121 R135-R141 R155-R161 R175-R181 R195-R201 = R_0805: 贴片电阻
R111 R113 R131 R133 R151 R153 R171 R173 R191 R193 = R_2512: 贴片电阻; Footprint Index: R_2512
RN1-RN4 = R_0204: 贴片晶圆电阻; Footprint Index: R_0204
RV1-RV5 = R-RV_3296W: 直插可调电阻
S1 S2 = SW_4.5X4.5X1.6: 贴片轻触按键
S3 = SW-DT-SIP_6X6X7: 侧脚6x6x7微动开关
SL1 = HDR-XH2.54A_8P: XH2.54直针插座
SW1-SW5 = SW_DSHP-1.27_04: 贴片拨码开关
TVS1 = Diode-TVS_SOT-143: TVS二极管阵列
U1 = Slot-TF Card_SPI Mode: TF卡插槽
U10 U15 U16 = IC-N532: 通用功率开关控制器
U111 U131 U151 U171 U191 = IC-TMC2226: 步进电机控制器
X1-X5 = HDR-XH2.54A_4P: XH2.54直针插座
X7-X9 = HDR-XH2.54A_2P: XH2.54直针插座
X10 X12 X15 X16 = HDR-2EDGRC-3.81_2P: 封口弯针插座-3.81
X11 = HDR-KF301-5.0_2P: 螺钉式接线端子-5.0直针
X14 = HDR-Farmertek USB3.0_Type_A: USB3.0母座